# EAGLE design SUM_1_0 (EAGLE 8.3.2)
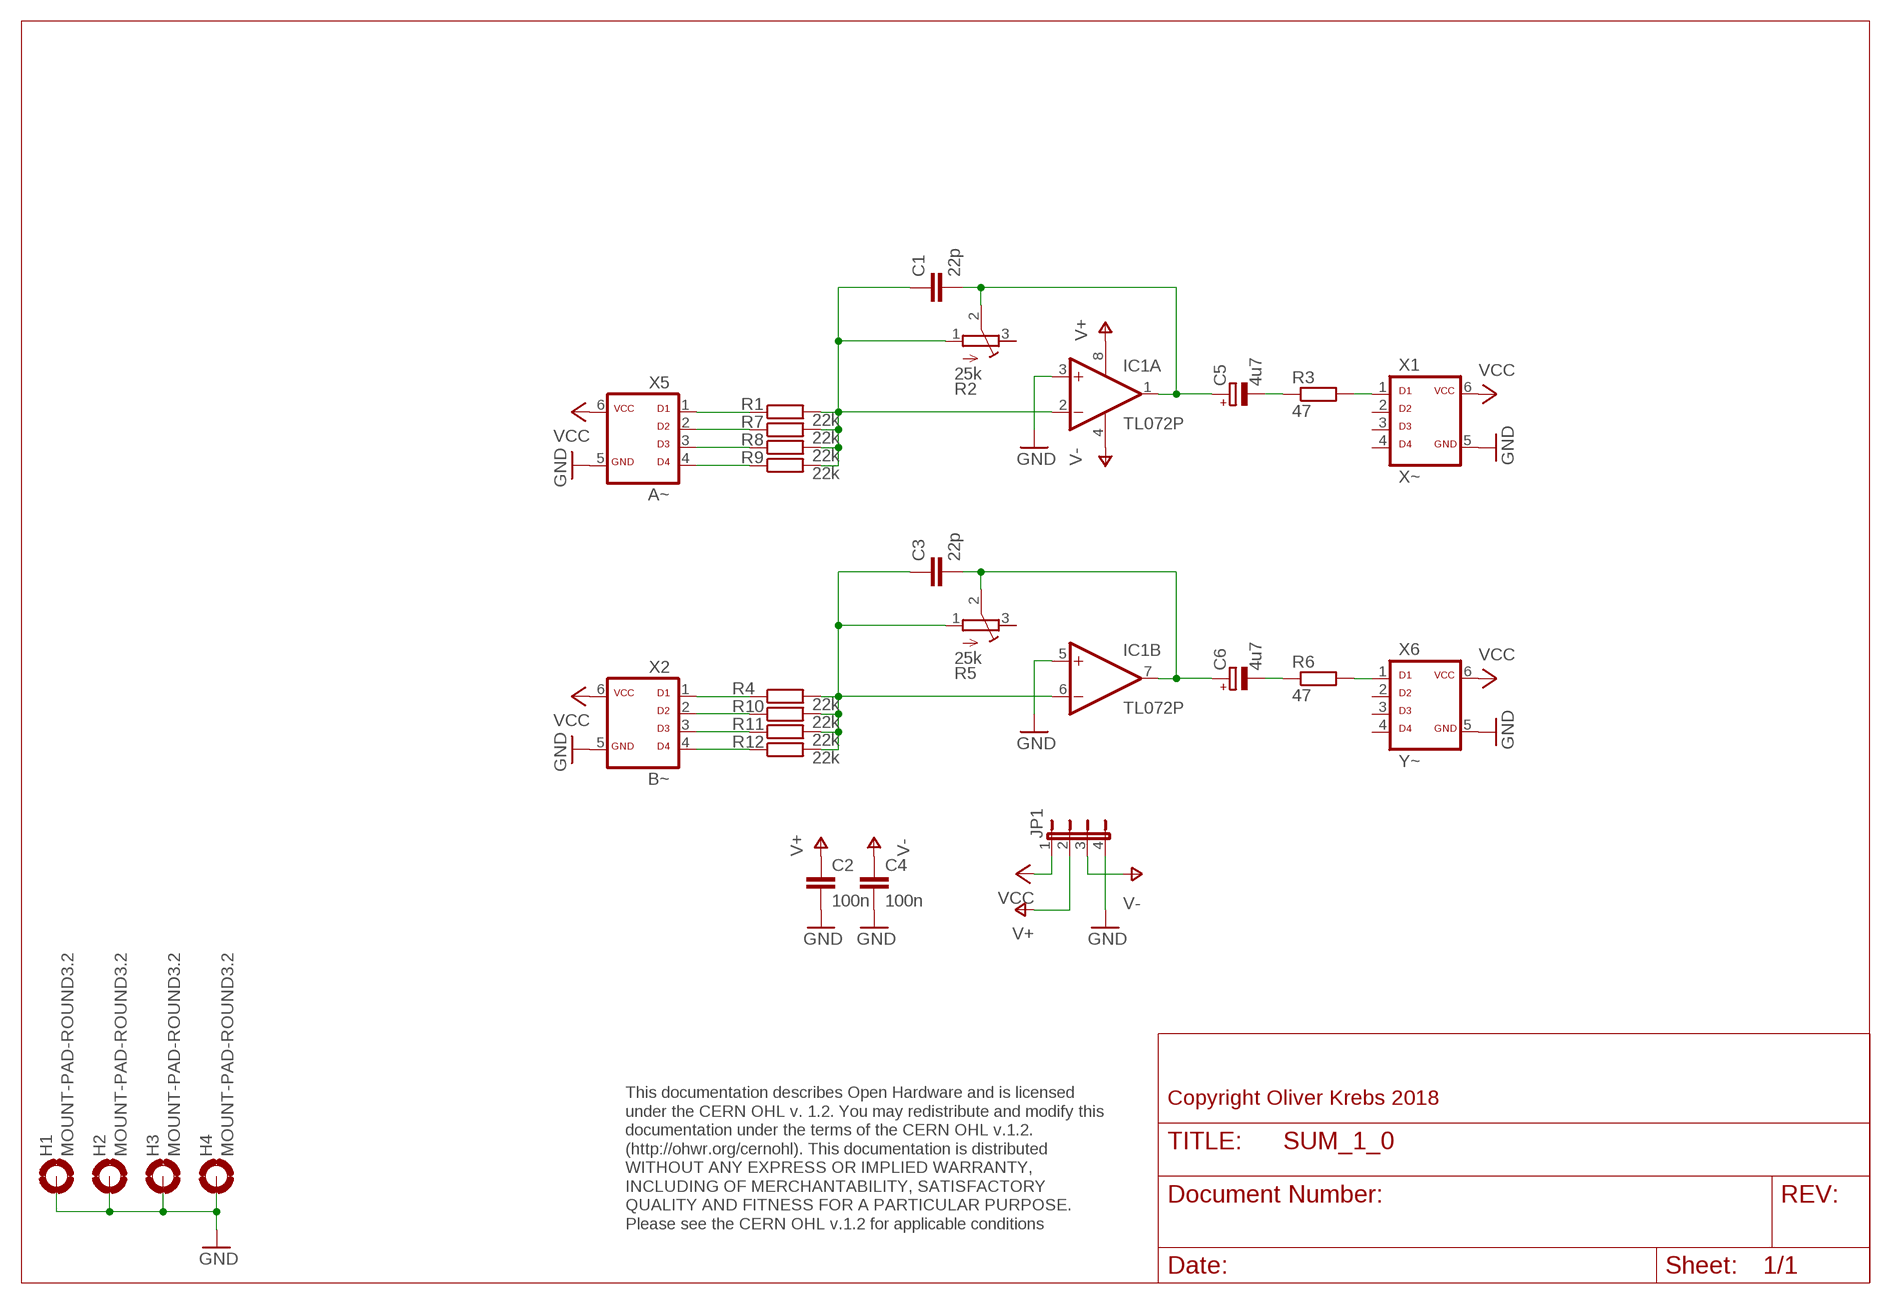
[diagram p0: schematic, sheet 1]

## Parts
C1  22p  C-EU050-025X075  [C050-025X075]
C2  100n  C-EU050-025X075  [C050-025X075]
C3  22p  C-EU050-025X075  [C050-025X075]
C4  100n  C-EU050-025X075  [C050-025X075]
C5  4u7  CPOL-EUE2-4  [E2-4]
C6  4u7  CPOL-EUE2-4  [E2-4]
H1  MOUNT-PAD-ROUND3.2  [3,2-PAD]
H2  MOUNT-PAD-ROUND3.2  [3,2-PAD]
H3  MOUNT-PAD-ROUND3.2  [3,2-PAD]
H4  MOUNT-PAD-ROUND3.2  [3,2-PAD]
IC1  TL072P  [DIL08]
JP1  JP4E  [JP4]
R1  22k  R-EU_0207/10  [0207/10]
R2  25k  R-TRIMMACP  [ACP-6L]
R3  47  R-EU_0207/10  [0207/10]
R4  22k  R-EU_0207/10  [0207/10]
R5  25k  R-TRIMMACP  [ACP-6L]
R6  47  R-EU_0207/10  [0207/10]
R7  22k  R-EU_0207/10  [0207/10]
R8  22k  R-EU_0207/10  [0207/10]
R9  22k  R-EU_0207/10  [0207/10]
R10  22k  R-EU_0207/10  [0207/10]
R11  22k  R-EU_0207/10  [0207/10]
R12  22k  R-EU_0207/10  [0207/10]
X1  X~  ML6D  [ML-6]
X2  B~  ML6D  [ML-6]
X5  A~  ML6D  [ML-6]
X6  Y~  ML6D  [ML-6]

## Nets
GND: C2.2 C4.2 H1.B3,2(MOUNT) H2.B3,2(MOUNT) H3.B3,2(MOUNT) H4.B3,2(MOUNT) IC1.3(A:+IN) IC1.5(B:+IN) JP1.4 X1.5 X2.5 X5.5 X6.5
N$1: C5.- R3.1
N$2: R3.2 X1.1
N$3: C1.2 C5.+ IC1.1(A:OUT) R2.2(S)
N$4: C3.2 C6.+ IC1.7(B:OUT) R5.2(S)
N$5: C1.1 IC1.2(A:-IN) R1.2 R2.1(A) R7.2 R8.2 R9.2
N$6: R7.1 X5.2
N$7: C3.1 IC1.6(B:-IN) R4.2 R5.1(A) R10.2 R11.2 R12.2
N$8: C6.- R6.1
N$9: R4.1 X2.1
N$10: R1.1 X5.1
N$11: R8.1 X5.3
N$12: R9.1 X5.4
N$13: R6.2 X6.1
N$14: R10.1 X2.2
N$15: R11.1 X2.3
N$16: R12.1 X2.4
V+: C2.1 IC1.8(P:V+) JP1.2
V-: C4.1 IC1.4(P:V-) JP1.3
VCC: JP1.1 X1.6 X2.6 X5.6 X6.6
Unconnected: R2.3(E) R5.3(E) X1.2 X1.3 X1.4 X6.2 X6.3 X6.4

## Notes on the sheet
- Copyright Oliver Krebs 2018
- This documentation describes Open Hardware and is licensed 
  under the CERN OHL v. 1.2. You may redistribute and modify this 
  documentation under the terms of the CERN OHL v.1.2. 
  (http://ohwr.org/cernohl). This documentation is distributed
  WITHOUT ANY EXPRESS OR IMPLIED WARRANTY, 
  INCLUDING OF MERCHANTABILITY, SATISFACTORY 
  QUALITY AND FITNESS FOR A PARTICULAR PURPOSE. 
  Please see the CERN OHL v.1.2 for applicable conditions

## Library data of the parts
C1-C4 = 01-my_rcl:C-EU: CAPACITOR, European symbol
C5 C6 = 01-my_rcl:CPOL-EU: POLARIZED CAPACITOR, European symbol
H1-H4 = holes:MOUNT-PAD-ROUND: MOUNTING PAD, round
IC1 = 01-my-linear:TL072: OP AMP
JP1 = 01-my-jumper:JP4E: JUMPER
R1 R3 R4 R6-R12 = 01-my_rcl:R-EU_: RESISTOR, European symbol
R2 R5 = 01-my_rcl:R-TRIMM: Trimm resistor
X1 X2 X5 X6 = 01-my-con:ML6D

## Board
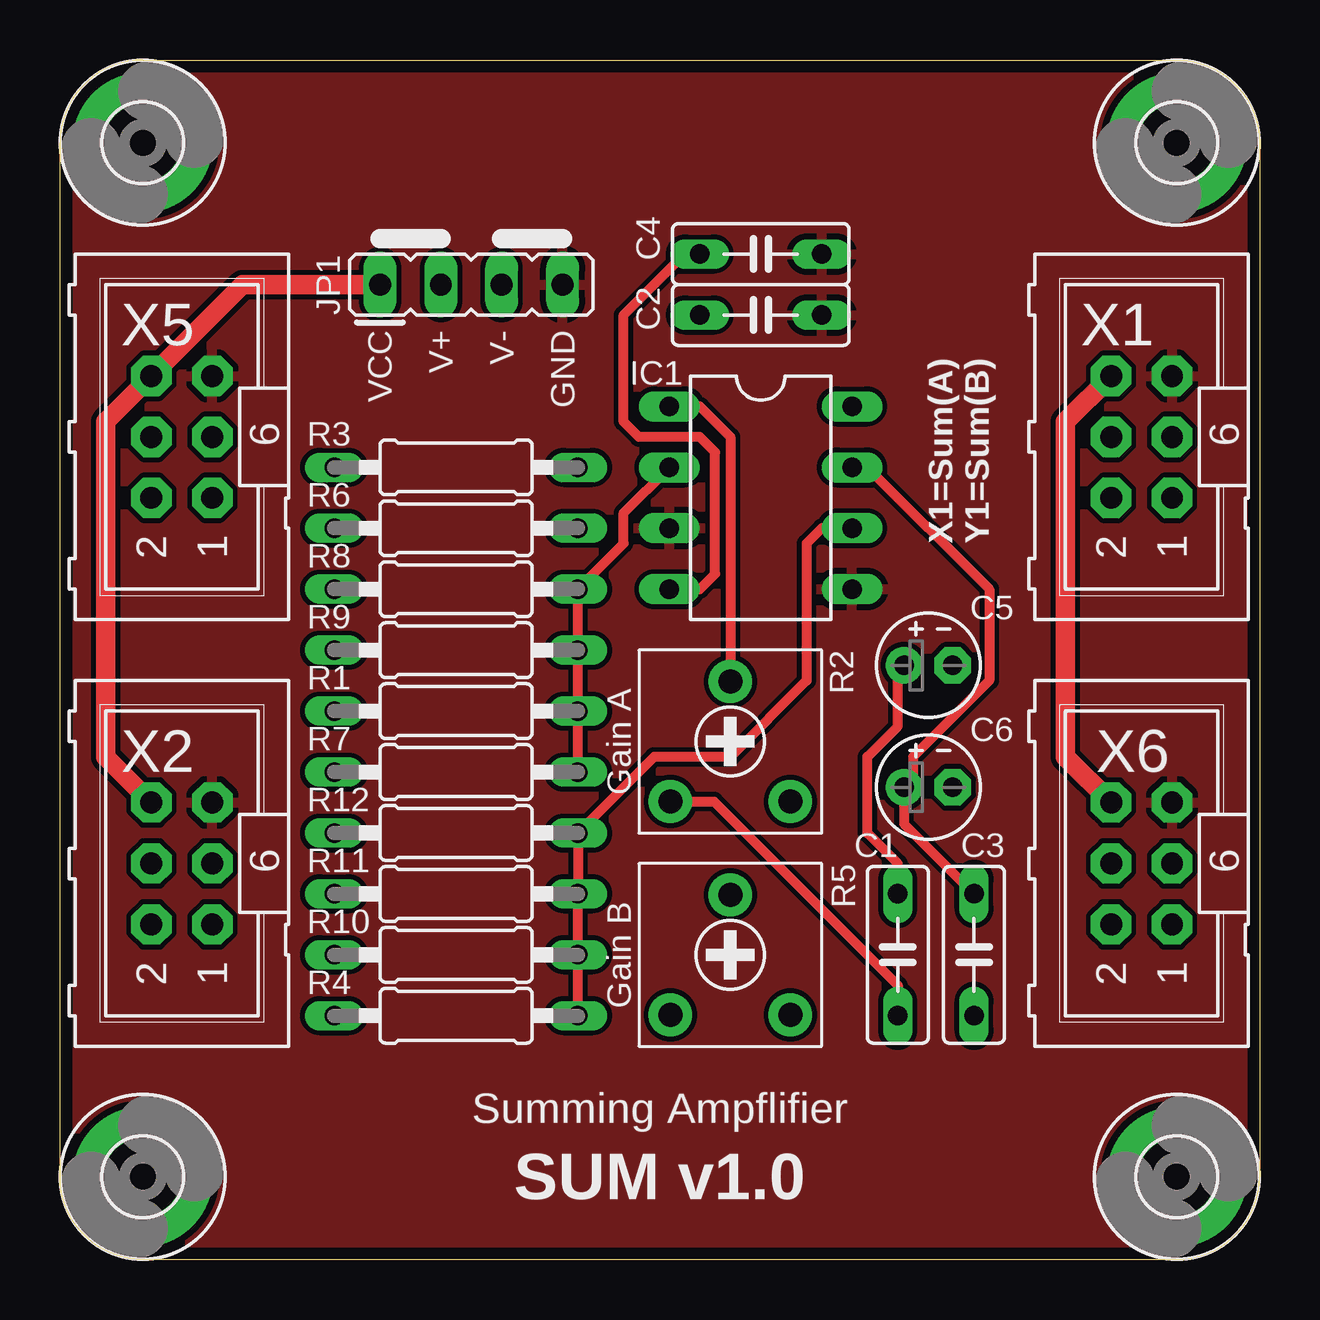
[diagram p1: board, top side]
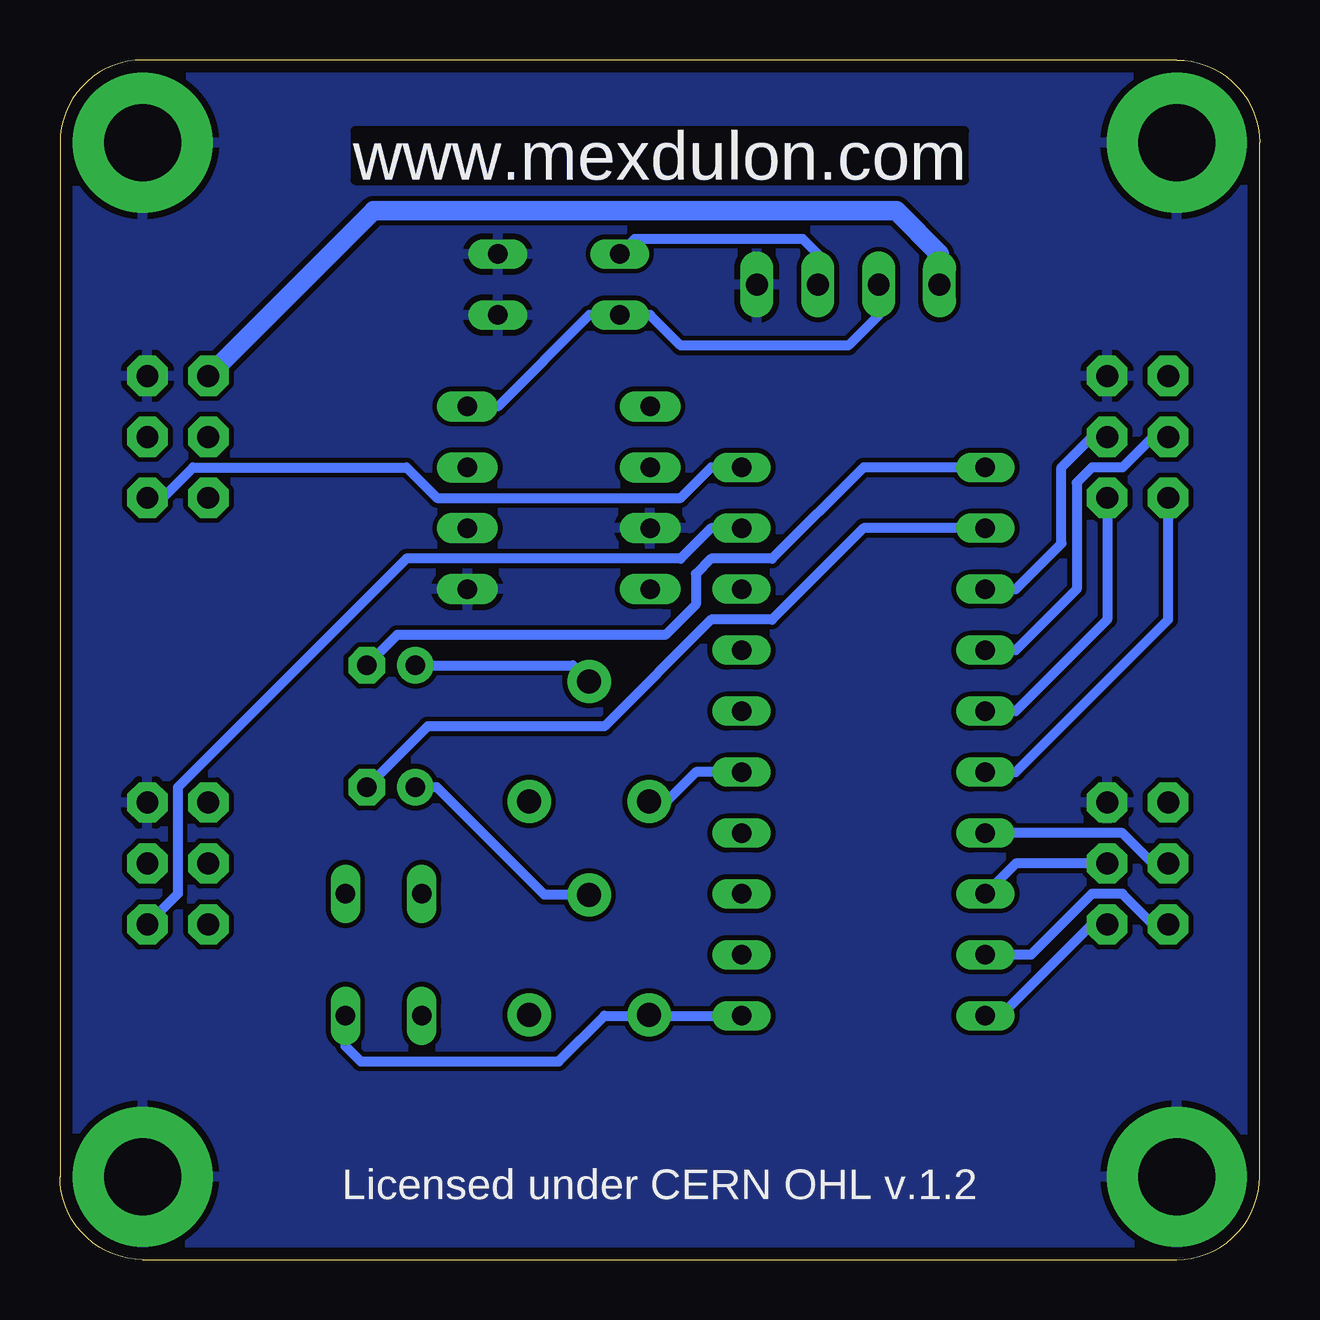
[diagram p2: board, bottom side, seen from below]

Size 50 x 50 mm. Coordinates in mm from the lower left corner, seen from the top.
Outline: 0,3.45 0,46.55 arc-90 3.45,50 46.55,50 arc-90 50,46.55 50,3.45 arc-90 46.55,0 3.45,0 arc-90 0,3.45
Copper layers (1*16): Top 0.035mm / dielectric 1.6mm / Bottom 0.035mm
Design rules "Elecrow_2-layer_PCB_eagle_rule_8mil": minimum track width 8mil, minimum drill 12mil, track to track 8mil, track to pad 8mil, pad to pad 8mil, via to via 8mil, smd to smd 0mil, copper to edge 20mil, drill to drill 10mil, minimum pad ring 6mil, minimum via ring 6mil, stop-mask expansion 0mil, vias tented up to drill 100mil, thermal gap 10mil

### Footprints (pad centres in the part's own frame; a part is rotated, then mirrored left to right if it is on the bottom)
C050-025X075 = drill 0.813 long: 1 -2.54,0; 2 2.54,0
E2-4 = drill 0.813 pad 1.524: + -1.016,0 | drill 0.813 pad 1.524 octagon: - 1.016,0
3,2-PAD = drill 3.2 pad 5.842: B3,2 0,0
DIL08 = drill 0.813 pad 1.27 long: 1 -3.81,-3.81; 2 -1.27,-3.81; 3 1.27,-3.81; 4 3.81,-3.81; 5 3.81,3.81; 6 1.27,3.81; 7 -1.27,3.81; 8 -3.81,3.81
JP4 = drill 0.914 long: 1 -3.81,0; 2 -1.27,0; 3 1.27,0; 4 3.81,0
0207/10 = drill 0.813 long: 1 -5.08,0; 2 5.08,0
ACP-6L = drill 1 pad 1.8: 1 -2.5,-2.5; 2 0,2.5; 3 2.5,-2.5
ML-6 = drill 0.914 pad 1.676 octagon: 1 -2.54,-1.27; 2 -2.54,1.27; 3 0,-1.27; 4 0,1.27; 5 2.54,-1.27; 6 2.54,1.27

### Placement (x,y rotation side)
C1  34.92,12.7 90 top
C2  29.21,39.37 0 top
C3  38.1,12.7 90 top
C4  29.21,41.91 0 top
C5  36.2,24.77 0 top
C6  36.2,19.68 0 top
H1  3.45,3.45 0 top
H2  3.45,46.55 0 top
H3  46.55,46.55 0 top
H4  46.55,3.45 0 top
IC1  29.21,31.75 270 top
JP1  17.14,40.64 0 top
R1  16.51,22.86 0 top
R2  27.94,21.59 0 top
R3  16.51,33.02 0 top
R4  16.51,10.16 0 top
R5  27.94,12.7 0 top
R6  16.51,30.48 0 top
R7  16.51,20.32 0 top
R8  16.51,27.94 0 top
R9  16.51,25.4 0 top
R10  16.51,12.7 0 top
R11  16.51,15.24 0 top
R12  16.51,17.78 0 top
X1  45.09,34.29 90 top
X2  5.08,16.51 90 top
X5  5.08,34.29 90 top
X6  45.09,16.51 90 top

### Tracks (layer width: path | path; a pad name or v marks a point on that pad's centre or on a via)
GND
  pour Bottom (isolate 0.203): 0,50.16 50.8,50.16 50.8,0 0,0
  pour Top (isolate 0.203): 0,50.16 50.8,50.16 50.8,0 0,0
N$1
  Bottom 0.406: R3.1 16.51,33.02 20.32,29.21 22.86,29.21 23.5,28.57 23.5,27.3 24.77,26.04 35.94,26.04 C5.-
N$2
  Bottom 0.406: X1.1 45.72,31.75 44.45,33.02 35.56,33.02 34.29,31.75 24.13,31.75 22.86,33.02 R3.2
N$3
  Top 0.406: IC1.1 26.67,35.56 27.94,34.29 R2.2 | C1.2 34.92,16.51 33.66,17.78 33.66,20.95 34.92,22.23 34.92,24.51 C5.+
  Bottom 0.406: C5.+ 28.61,24.77 R2.2
N$4
  Top 0.406: C3.2 35.18,18.16 C6.+ 35.56,20.07 35.56,20.95 38.73,24.13 38.73,27.94 33.66,33.02 IC1.7
  Bottom 0.406: R5.2 29.8,15.2 34.29,19.68 C6.+
N$5
  Top 0.406: R7.2 R1.2 R9.2 R8.2 23.5,29.84 23.5,31.11 IC1.2 | R2.1 27.27,19.09 34.92,11.43 C1.1
  Bottom 0.406: R7.2 23.5,20.32 24.77,19.05 25.4,19.05 R2.1
N$6
  Bottom 0.406: R7.1 10.16,20.32 3.81,26.67 X5.2
N$7
  Top 0.406: R4.2 R10.2 R11.2 R12.2 24.77,20.95 27.94,20.95 31.11,24.13 31.11,29.84 31.75,30.48 IC1.6
  Bottom 0.406: 25.4,10.16 R4.2 | 25.4,10.16 R5.1 | C3.1 38.1,8.89 37.47,8.26 29.21,8.26 27.3,10.16 25.4,10.16
N$8
  Bottom 0.406: R6.1 16.51,30.48 20.32,26.67 22.86,26.67 27.3,22.23 34.67,22.23 C6.-
N$9
  Bottom 0.406: X2.1 6.99,13.97 10.79,10.16 R4.1
N$10
  Bottom 0.406: X5.1 6.35,26.67 10.16,22.86 R1.1
N$11
  Bottom 0.406: R8.1 10.16,27.94 8.26,29.84 8.26,33.02 6.99,34.29 X5.3
N$12
  Bottom 0.406: X5.4 4.45,34.29 5.71,33.02 6.99,33.02 7.62,32.38 7.62,27.94 10.16,25.4 R9.1
N$13
  Bottom 0.406: R6.2 22.86,30.48 24.13,29.21 35.56,29.21 45.09,19.68 45.09,15.24 X6.1
N$14
  Bottom 0.406: X2.2 4.45,13.97 5.71,15.24 6.99,15.24 9.53,12.7 R10.1
N$15
  Bottom 0.406: X2.3 10.16,16.51 R11.1
N$16
  Bottom 0.406: X2.4 4.45,16.51 5.71,17.78 R12.1
V+
  Bottom 0.406: IC1.8 31.75,35.56 27.94,39.37 C2.1 25.4,39.37 24.13,38.1 17.14,38.1 15.88,39.37 JP1.2
V-
  Top 0.406: IC1.4 26.67,27.94 27.3,28.57 27.3,33.66 26.67,34.29 24.13,34.29 23.5,34.92 23.5,39.37 26.04,41.91 C4.1
  Bottom 0.406: C4.1 26.04,42.55 19.05,42.55 18.41,41.91 JP1.3
VCC
  Top 0.813: X1.6 41.91,34.92 41.91,20.95 X6.6 | X2.6 1.91,20.95 1.91,34.92 X5.6 7.62,40.64 JP1.1
  Bottom 0.813: JP1.1 13.34,41.91 15.14,43.71 36.93,43.71 X1.6

### Text on the board
Bottom: www.mexdulon.com
tNames: VCC | V+ | V- | GND | X1=Sum(A) / Y1=Sum(B) | Gain A | Gain B | Summing Ampflifier | SUM v1.0
bNames: www.mexdulon.com | Licensed under CERN OHL v.1.2
200bmp: E:/Bilder/Elektronik/Modulion/Mexdulon/mexdulon_50x50_pcb.bmp